# EAGLE schematic phone (EAGLE 9.6.2)
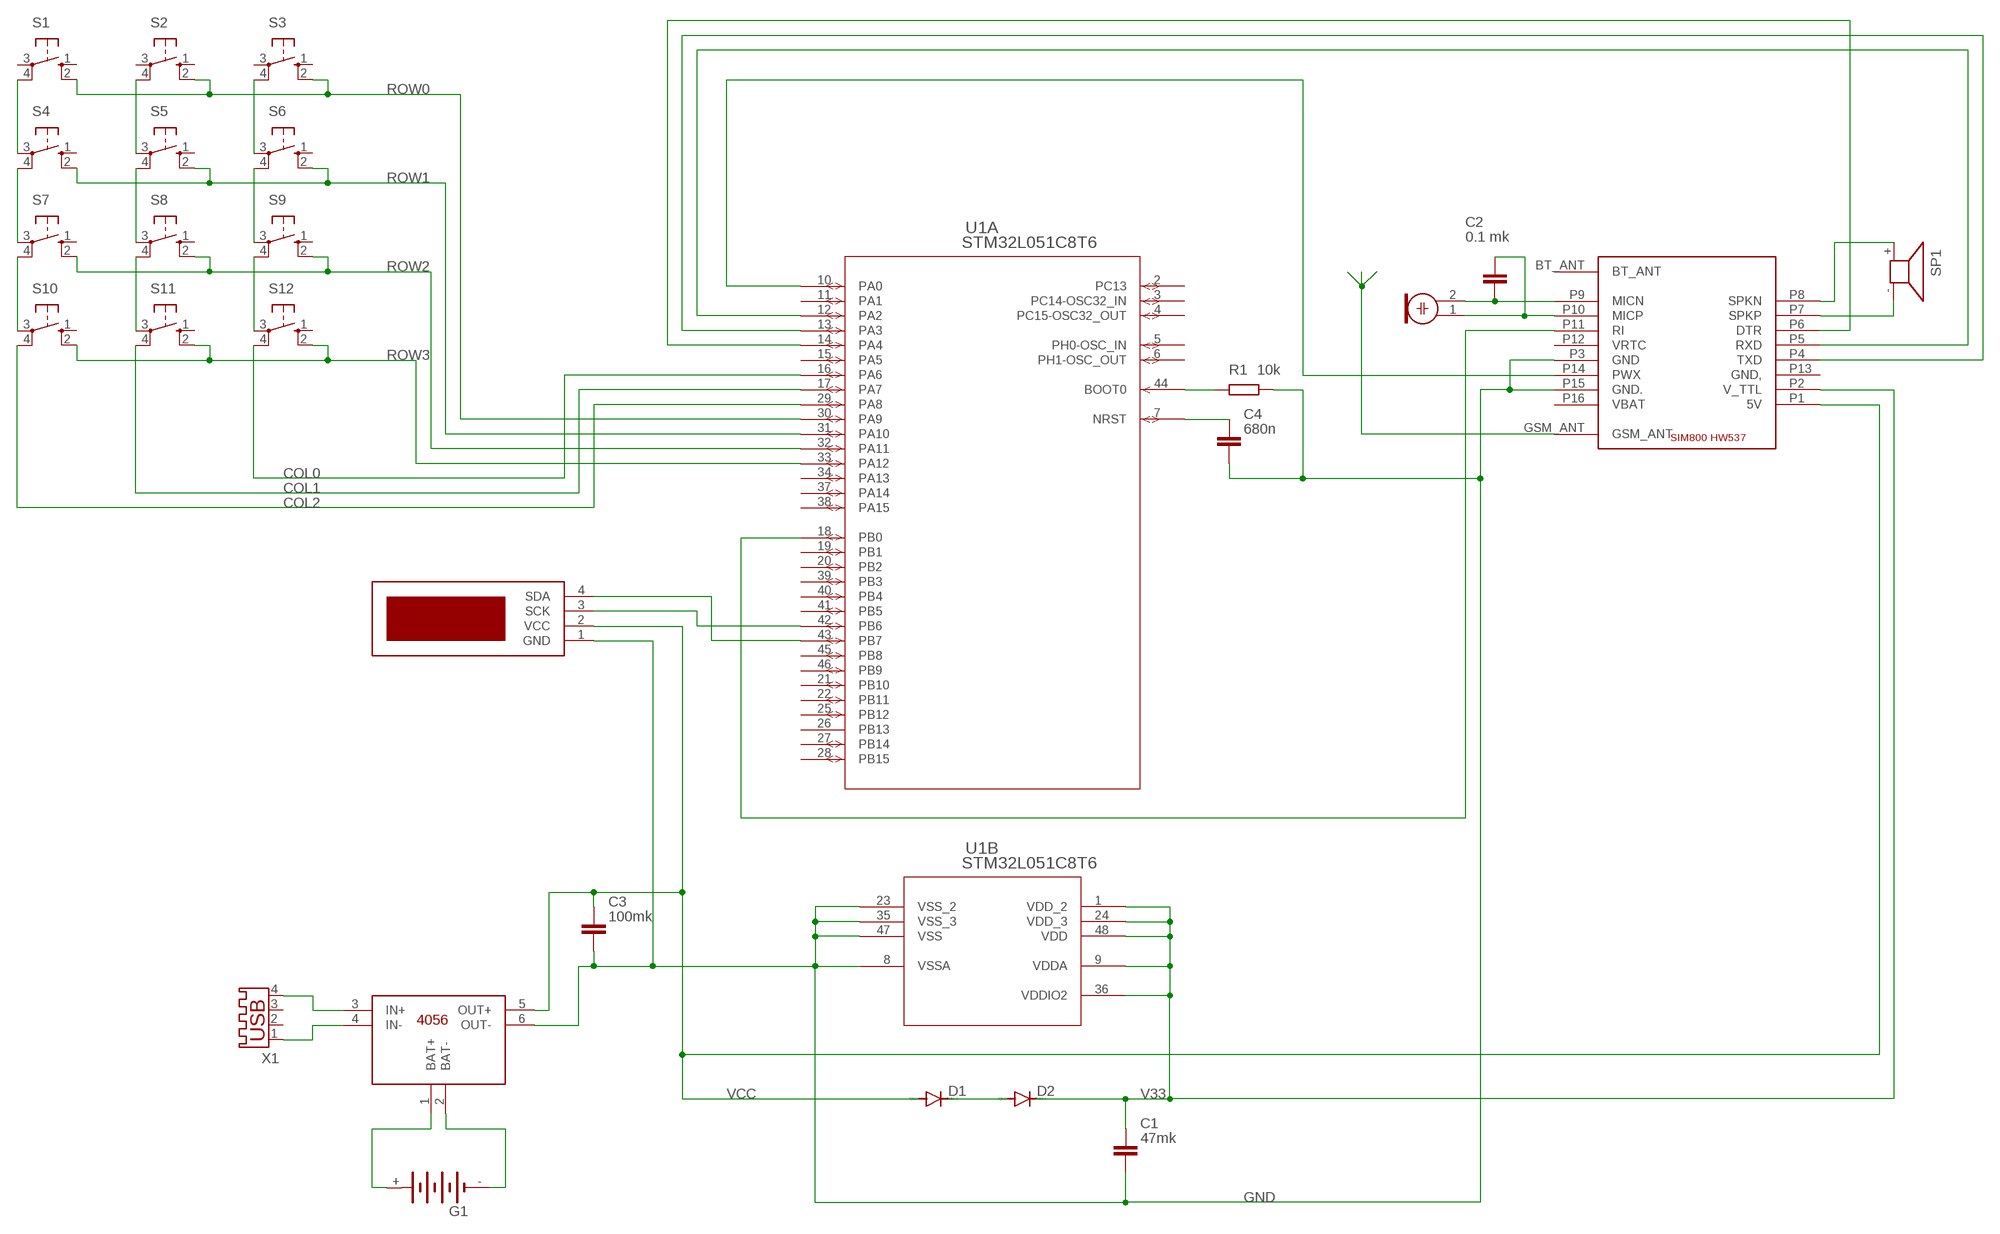
[diagram p0: schematic, sheet 1]

## Parts
C1  47mk  C_CHIP-0402(1005-METRIC)  [CAPC1005X60]
C2  0.1 mk  C_CHIP-0402(1005-METRIC)  [CAPC1005X60]
C3  100mk  C_CHIP-0402(1005-METRIC)  [CAPC1005X60]
C4  680n  C_CHIP-0402(1005-METRIC)  [CAPC1005X60]
D1  1N4148DO35-7  [DO35-7]
D2  1N4148DO35-7  [DO35-7]
G1  VST4V8  [VST4]
M1  ELECTRET_MICROPHON-WM-61A  [WM-61A]
R1  10k  R  (no package)
S1  10-XX  [B3F-10XX]
S2  10-XX  [B3F-10XX]
S3  10-XX  [B3F-10XX]
S4  10-XX  [B3F-10XX]
S5  10-XX  [B3F-10XX]
S6  10-XX  [B3F-10XX]
S7  10-XX  [B3F-10XX]
S8  10-XX  [B3F-10XX]
S9  10-XX  [B3F-10XX]
S10  10-XX  [B3F-10XX]
S11  10-XX  [B3F-10XX]
S12  10-XX  [B3F-10XX]
SP1  KSS1201  [KSS1201]
U1  STM32L051C8T6  [LQFP48-7X7MM]
U$1  SIM800  [SIM800C_HW537_PACKAGE]
U$2  LCD_I2C4-PIN  [P04A]
U$3  4056  [DIL08]
X1  USB-A003  [USB-A003]

## Nets
COL0: S12.4(P1) U1.16(A:PA6)
COL1: S11.4(P1) U1.17(A:PA7)
COL2: S10.4(P1) U1.29(A:PA8)
GND: C1.2 C3.2 C4.2 R1.2 U1.8(B:VSSA) U1.23(B:VSS_2) U1.35(B:VSS_3) U1.47(B:VSS) U$1.P3(GND) U$1.P15(GND.) U$2.1(GND) U$3.6(OUT-)
N$1: U1.12(A:PA2) U$1.P5(RXD)
N$2: U1.13(A:PA3) U$1.P4(TXD)
N$3: U1.10(A:PA0) U$1.P14(PWX)
N$4: U1.43(A:PB7) U$2.4(SDA)
N$5: U1.42(A:PB6) U$2.3(SCK)
N$6: C4.1 U1.7(A:NRST)
N$7: R1.1 U1.44(A:BOOT0)
N$8: D1.C D2.A
N$9: U$3.3(IN+) X1.4
N$10: U$3.4(IN-) X1.1
N$11: G1.+ U$3.1(BAT+)
N$12: G1.- U$3.2(BAT-)
N$13: S1.4(P1) S4.3(P)
N$14: S4.4(P1) S7.3(P)
N$15: S7.4(P1) S10.3(P)
N$16: S2.4(P1) S5.3(P)
N$17: S5.4(P1) S8.3(P)
N$18: S8.4(P1) S11.3(P)
N$19: S3.4(P1) S6.3(P)
N$20: S6.4(P1) S9.3(P)
N$21: S9.4(P1) S12.3(P)
N$22: U1.14(A:PA4) U$1.P6(DTR)
N$23: SP1.+ U$1.P8(SPKN)
N$24: SP1.- U$1.P7(SPKP)
N$25: C2.2 M1.2 U$1.P9(MICN)
N$26: C2.1 M1.1 U$1.P10(MICP)
N$27: U$1.GSM_ANT
N$29: U1.18(A:PB0) U$1.P11(RI)
ROW0: S1.2(S1) S2.2(S1) S3.2(S1) U1.30(A:PA9)
ROW1: S4.2(S1) S5.2(S1) S6.2(S1) U1.31(A:PA10)
ROW2: S7.2(S1) S8.2(S1) S9.2(S1) U1.32(A:PA11)
ROW3: S10.2(S1) S11.2(S1) S12.2(S1) U1.33(A:PA12)
V33: C1.1 D2.C U1.1(B:VDD_2) U1.9(B:VDDA) U1.24(B:VDD_3) U1.36(B:VDDIO2) U1.48(B:VDD) U$1.P2(V_TTL)
VCC: C3.1 D1.A U$1.P1(5V) U$2.2(VCC) U$3.5(OUT+)
Unconnected: G1.+@1(+) S1.1(S) S1.3(P) S2.1(S) S2.3(P) S3.1(S) S3.3(P) S4.1(S) S5.1(S) S6.1(S) S7.1(S) S8.1(S) S9.1(S) S10.1(S) S11.1(S) S12.1(S) U1.2(A:PC13) U1.3(A:PC14-OSC32_IN) U1.4(A:PC15-OSC32_OUT) U1.5(A:PH0-OSC_IN) U1.6(A:PH1-OSC_OUT) U1.11(A:PA1) U1.15(A:PA5) U1.19(A:PB1) U1.20(A:PB2) U1.21(A:PB10) U1.22(A:PB11) U1.25(A:PB12) U1.26(A:PB13) U1.27(A:PB14) U1.28(A:PB15) U1.34(A:PA13) U1.37(A:PA14) U1.38(A:PA15) U1.39(A:PB3) U1.40(A:PB4) U1.41(A:PB5) U1.45(A:PB8) U1.46(A:PB9) X1.2 X1.3

## Power pins joined to a net without a drawn wire
BT_ANT: U$1.BT_ANT
GND,: U$1.P13(GND,)
VBAT: U$1.P16(VBAT)
VRTC: U$1.P12(VRTC)

## Library data of the parts
C1-C4 = Capacitor:C: Capacitor - Generic; CATEGORY: Capacitor
D1 D2 = diode:1N4148: DIODE high speed (Philips)
G1 = battery:VST4V8: NC ACCU Varta Safe Tronic 4V8
M1 = microphon:ELECTRET_MICROPHON-: Electret Condenser Microphone
R1 = ngspice-simulation:R: RESISTOR
S1-S12 = switch-omron:10-XX: OMRON SWITCH; MPN: B3F-1000; OC_FARNELL: 176432; OC_NEWARK: 36M3542
SP1 = buzzer:KSS1201: SPEAKER Source: Schukat; OC_FARNELL: unknown; OC_NEWARK: unknown
U1 = MyLib:STM32L051C8T6; COPYRIGHT: Copyright (C) 2026 Ultra Librarian. All rights reserved.; DATASHEET: https://www.st.com/resource/en/datasheet/stm32l051c6.pdf; DESCRIPTION: Ultra-low-power Arm Cortex-M0+ MCU with 64 Kbytes of Flash memory, 32 MHz CPU; MANUFACTURER_NAME: STMicroelectronics; MANUFACTURER_PART_NUMBER: STM32L051C8T6
U$1 = MyLib:SIM800
U$2 = MyLib:LCD_I2C
U$3 = MyLib:4056
X1 = con-yamaichi:USB-A003: USB connector; OC_FARNELL: unknown; OC_NEWARK: unknown